# EAGLE schematic power_board2_v1.0 (EAGLE 9.5.1)
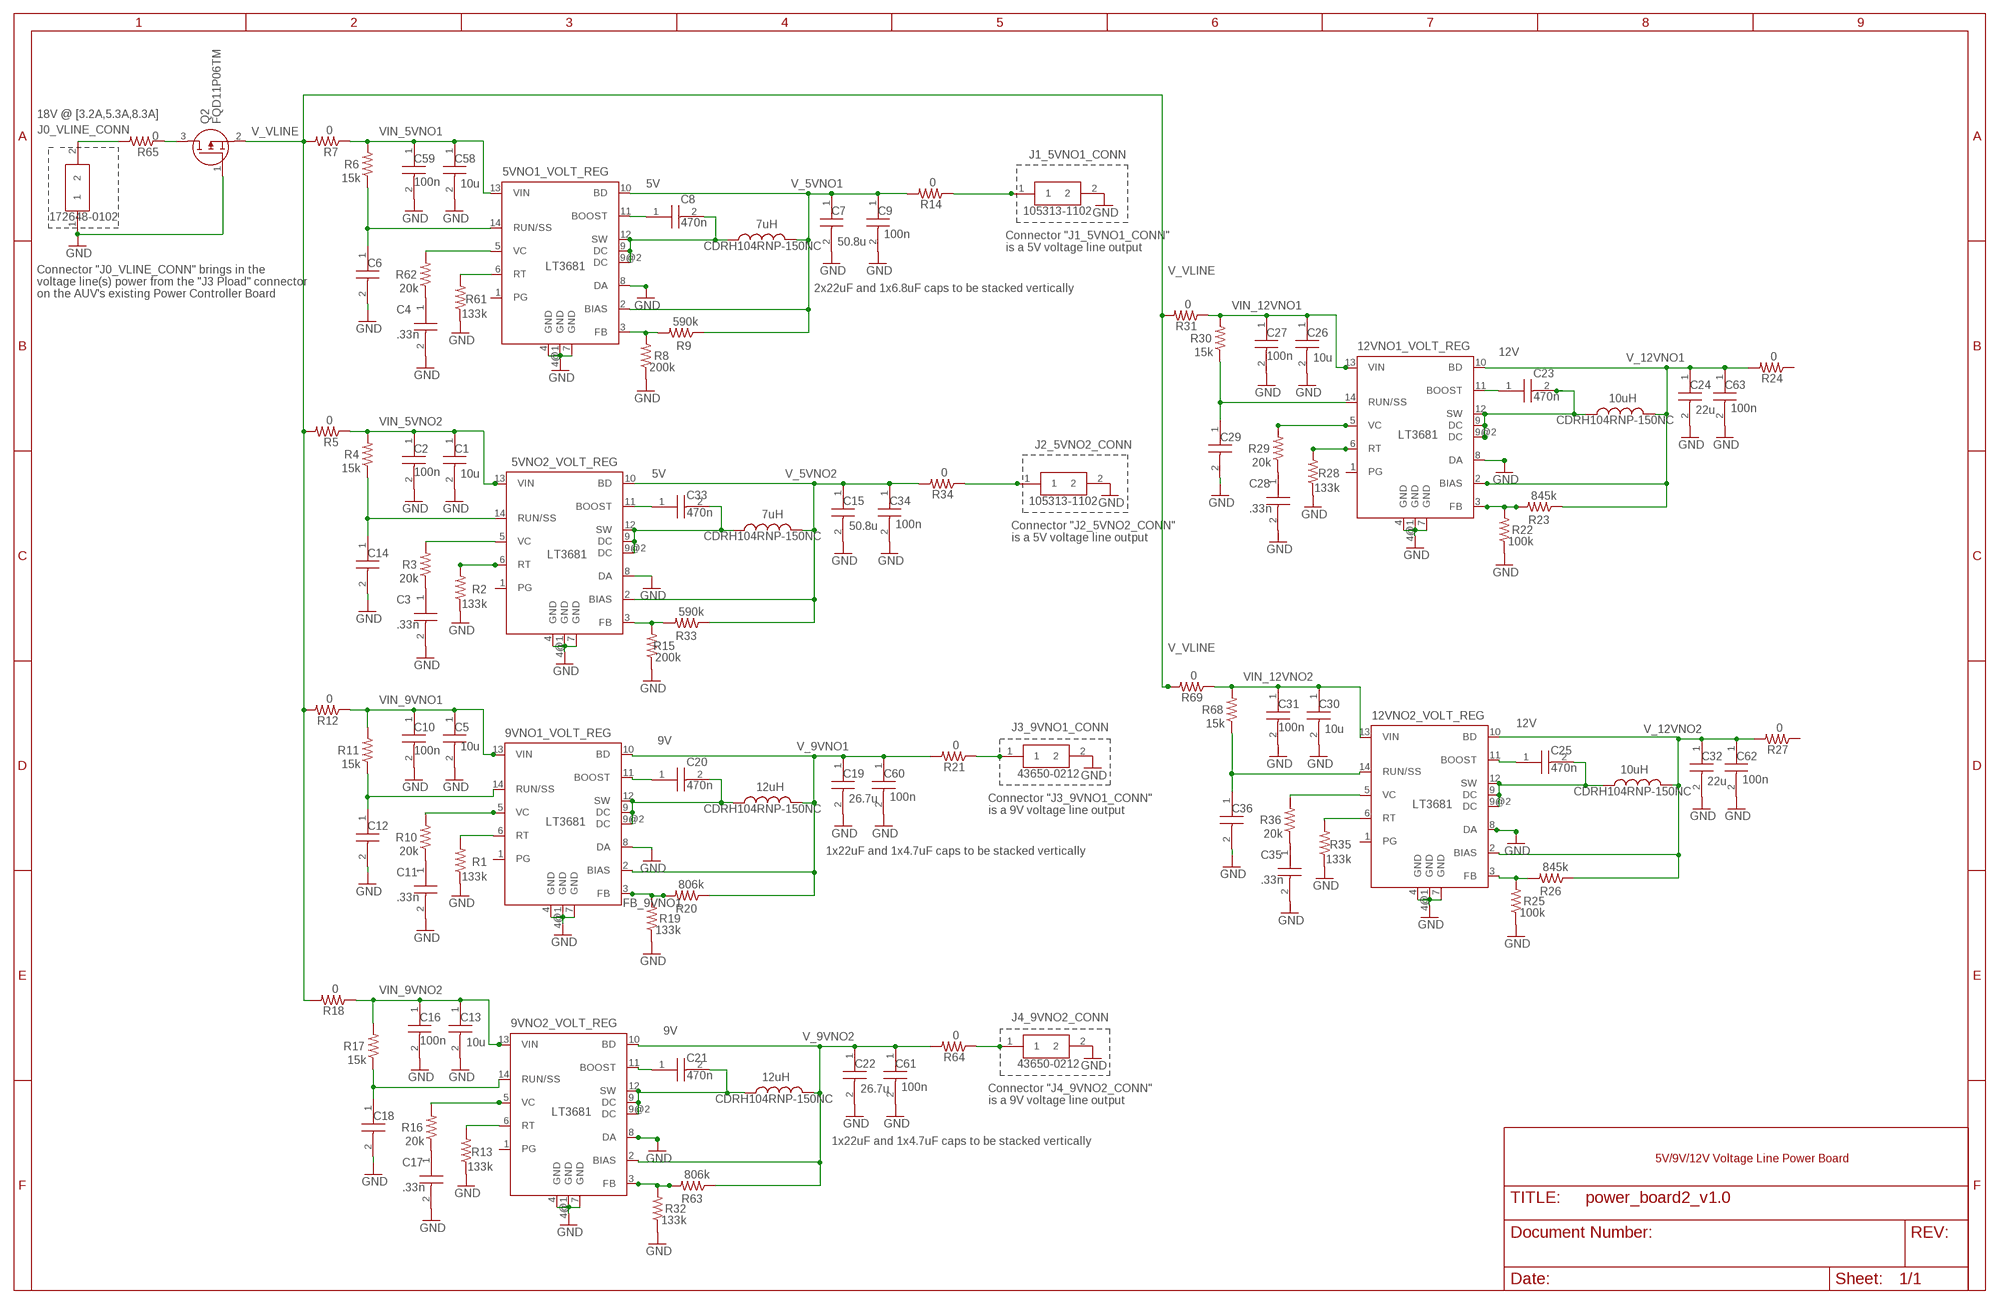
[diagram p0: schematic, sheet 1]

## Parts
5VNO1_VOLT_REG  LT3681  [DFN14-4X3DE]
5VNO2_VOLT_REG  LT3681  [DFN14-4X3DE]
9VNO1_VOLT_REG  LT3681  [DFN14-4X3DE]
9VNO2_VOLT_REG  LT3681  [DFN14-4X3DE]
12VNO1_VOLT_REG  LT3681  [DFN14-4X3DE]
12VNO2_VOLT_REG  LT3681  [DFN14-4X3DE]
C1  10u  22201C106KAT2A  [CAPC5750X279N]
C2  100n  06031C104KAT2A  [CAPC1608X90N]
C3  .33n  08053C334KAT2A  [CAPC2012X140N]
C4  .33n  08053C334KAT2A  [CAPC2012X140N]
C5  10u  22201C106KAT2A  [CAPC5750X279N]
C6  220n  08051C224KAT2A  [CAPC2012X140N]
C7  50.8u  12103C226KAT2A  [CAPC3225X279N]
C8  470n  06033C474JAT2A  [CAPC1608X90N]
C9  100n  06033C104KAT4A  [CAPC1608X90N]
C10  100n  06031C104KAT2A  [CAPC1608X90N]
C11  .33n  08053C334KAT2A  [CAPC2012X140N]
C12  220n  08051C224KAT2A  [CAPC2012X140N]
C13  10u  22201C106KAT2A  [CAPC5750X279N]
C14  220n  08051C224KAT2A  [CAPC2012X140N]
C15  50.8u  12103C226KAT2A  [CAPC3225X279N]
C16  100n  06031C104KAT2A  [CAPC1608X90N]
C17  .33n  08053C334KAT2A  [CAPC2012X140N]
C18  220n  08051C224KAT2A  [CAPC2012X140N]
C19  26.7u  12103C226KAT2A  [CAPC3225X279N]
C20  470n  06033C474JAT2A  [CAPC1608X90N]
C21  470n  06033C474JAT2A  [CAPC1608X90N]
C22  26.7u  12103C226KAT2A  [CAPC3225X279N]
C23  470n  06033C474JAT2A  [CAPC1608X90N]
C24  50.8u  12103C226KAT2A  [CAPC3225X279N]
C25  470n  06033C474JAT2A  [CAPC1608X90N]
C26  10u  22201C106KAT2A  [CAPC5750X279N]
C27  100n  06031C104KAT2A  [CAPC1608X90N]
C28  .33n  08053C334KAT2A  [CAPC2012X140N]
C29  220n  08051C224KAT2A  [CAPC2012X140N]
C30  10u  22201C106KAT2A  [CAPC5750X279N]
C31  100n  06031C104KAT2A  [CAPC1608X90N]
C32  50.8u  12103C226KAT2A  [CAPC3225X279N]
C33  470n  06033C474JAT2A  [CAPC1608X90N]
C34  100n  06033C104KAT4A  [CAPC1608X90N]
C35  .33n  08053C334KAT2A  [CAPC2012X140N]
C36  220n  08051C224KAT2A  [CAPC2012X140N]
C58  10u  22201C106KAT2A  [CAPC5750X279N]
C59  100n  06031C104KAT2A  [CAPC1608X90N]
C60  100n  06033C104KAT4A  [CAPC1608X90N]
C61  100n  06033C104KAT4A  [CAPC1608X90N]
C62  100n  06033C104KAT4A  [CAPC1608X90N]
C63  100n  06033C104KAT4A  [CAPC1608X90N]
INDUCTOR_2  CDRH104RNP-150NC  [INDPM102100X400N]
INDUCTOR_4  CDRH104RNP-150NC  [INDPM102100X400N]
INDUCTOR_5  CDRH104RNP-150NC  [INDPM102100X400N]
INDUCTOR_6  CDRH104RNP-150NC  [INDPM102100X400N]
INDUCTOR_7  CDRH104RNP-150NC  [INDPM102100X400N]
INDUCTOR_8  CDRH104RNP-150NC  [INDPM102100X400N]
J0_VLINE_CONN  172648-0102  [1726480102]
J1_B3_CONN1  105313-1102  [1053131102]
J1_B3_CONN2  105313-1102  [1053131102]
J3_9VNO1_CONN  43650-0212  [43650-0214]
J4_9VNO2_CONN  43650-0212  [43650-0214]
Q2  FQD11P06TM  [DPAK3-CASE-369AS]
R1  133k  R-US_R0603  [R0603]
R2  133k  R-US_R0603  [R0603]
R3  20k  R-US_R0603  [R0603]
R4  15k  R-US_R0603  [R0603]
R5  0  R-US_0207/2V  [0207/2V]
R6  15k  R-US_R0603  [R0603]
R7  0  R-US_0207/2V  [0207/2V]
R8  200k  R-US_R0603  [R0603]
R9  590k  R-US_R0603  [R0603]
R10  20k  R-US_R0603  [R0603]
R11  15k  R-US_R0603  [R0603]
R12  0  R-US_0207/2V  [0207/2V]
R13  133k  R-US_R0603  [R0603]
R14  0  R-US_0207/2V  [0207/2V]
R15  200k  R-US_R0603  [R0603]
R16  20k  R-US_R0603  [R0603]
R17  15k  R-US_R0603  [R0603]
R18  0  R-US_0207/2V  [0207/2V]
R19  133k  R-US_R0603  [R0603]
R20  806k  R-US_R0603  [R0603]
R21  0  R-US_0207/2V  [0207/2V]
R22  100k  R-US_R0603  [R0603]
R23  845k  R-US_R0603  [R0603]
R24  0  R-US_0207/2V  [0207/2V]
R25  100k  R-US_R0603  [R0603]
R26  845k  R-US_R0603  [R0603]
R27  0  R-US_0207/2V  [0207/2V]
R28  133k  R-US_R0603  [R0603]
R29  20k  R-US_R0603  [R0603]
R30  15k  R-US_R0603  [R0603]
R31  0  R-US_0207/2V  [0207/2V]
R32  133k  R-US_R0603  [R0603]
R33  590k  R-US_R0603  [R0603]
R34  0  R-US_0207/2V  [0207/2V]
R35  133k  R-US_R0603  [R0603]
R36  20k  R-US_R0603  [R0603]
R61  133k  R-US_R0603  [R0603]
R62  20k  R-US_R0603  [R0603]
R63  806k  R-US_R0603  [R0603]
R64  0  R-US_0207/2V  [0207/2V]
R65  0  R-US_0207/2V  [0207/2V]
R68  15k  R-US_R0603  [R0603]
R69  0  R-US_0207/2V  [0207/2V]

## Nets
FB_5VNO1: 5VNO1_VOLT_REG.3(FB) R8.2 R9.2
FB_5VNO2: 5VNO2_VOLT_REG.3(FB) R15.2 R33.2
FB_9VNO1: 9VNO1_VOLT_REG.3(FB) R19.2 R20.2
FB_9VNO2: 9VNO2_VOLT_REG.3(FB) R32.2 R63.2
FB_12VNO1: 12VNO1_VOLT_REG.3(FB) R22.2 R23.2
FB_12VNO2: 12VNO2_VOLT_REG.3(FB) R25.2 R26.2
GND: 5VNO1_VOLT_REG.4(GND) 5VNO1_VOLT_REG.4@1(GND) 5VNO1_VOLT_REG.7(GND) 5VNO1_VOLT_REG.8(DA) 5VNO2_VOLT_REG.4(GND) 5VNO2_VOLT_REG.4@1(GND) 5VNO2_VOLT_REG.7(GND) 5VNO2_VOLT_REG.8(DA) 9VNO1_VOLT_REG.4(GND) 9VNO1_VOLT_REG.4@1(GND) 9VNO1_VOLT_REG.7(GND) 9VNO1_VOLT_REG.8(DA) 9VNO2_VOLT_REG.4(GND) 9VNO2_VOLT_REG.4@1(GND) 9VNO2_VOLT_REG.7(GND) 9VNO2_VOLT_REG.8(DA) 12VNO1_VOLT_REG.4(GND) 12VNO1_VOLT_REG.4@1(GND) 12VNO1_VOLT_REG.7(GND) 12VNO1_VOLT_REG.8(DA) 12VNO2_VOLT_REG.4(GND) 12VNO2_VOLT_REG.4@1(GND) 12VNO2_VOLT_REG.7(GND) C1.2 C2.2 C3.2 C4.2 C5.2 C6.2 C7.2 C9.2 C10.2 C11.2 C12.2 C13.2 C14.2 C15.2 C16.2 C17.2 C18.2 C19.2 C22.2 C24.2 C26.2 C27.2 C28.2 C29.2 C30.2 C31.2 C32.2 C34.2 C35.2 C36.2 C58.2 C59.2 C60.2 C61.2 C62.2 C63.2 J0_VLINE_CONN.1 J1_B3_CONN1.2 J1_B3_CONN2.2 J3_9VNO1_CONN.2 J4_9VNO2_CONN.2 Q2.1(G) R1.1 R2.1 R8.1 R13.1 R15.1 R19.1 R22.1 R25.1 R28.1 R32.1 R35.1 R61.1
N$1: C4.1 R62.1
N$2: 12VNO2_VOLT_REG.11(BOOST) C25.1
N$3: 12VNO1_VOLT_REG.11(BOOST) C23.1
N$4: C3.1 R3.1
N$5: C11.1 R10.1
N$6: C17.1 R16.1
N$7: 5VNO2_VOLT_REG.11(BOOST) C33.1
N$8: J4_9VNO2_CONN.1 R64.1
N$9: 9VNO2_VOLT_REG.11(BOOST) C21.1
N$10: 5VNO1_VOLT_REG.11(BOOST) C8.1
N$11: 9VNO1_VOLT_REG.11(BOOST) C20.1
N$12: J3_9VNO1_CONN.1 R21.1
N$17: C28.1 R29.1
N$18: C35.1 R36.1
RT_5VNO1: 5VNO1_VOLT_REG.6(RT) R61.2
RT_5VNO2: 5VNO2_VOLT_REG.6(RT) R2.2
RT_9VNO1: 9VNO1_VOLT_REG.6(RT) R1.2
RT_9VNO2: 9VNO2_VOLT_REG.6(RT) R13.2
RT_12VNO1: 12VNO1_VOLT_REG.6(RT) R28.2
RT_12VNO2: 12VNO2_VOLT_REG.6(RT) R35.2
RUN/SS_5VNO1: 5VNO1_VOLT_REG.14(RUN/SS) C6.1 R6.1
RUN/SS_5VNO2: 5VNO2_VOLT_REG.14(RUN/SS) C14.1 R4.1
RUN/SS_9VNO1: 9VNO1_VOLT_REG.14(RUN/SS) C12.1 R11.1
RUN/SS_9VNO2: 9VNO2_VOLT_REG.14(RUN/SS) C18.1 R17.1
RUN/SS_12VNO1: 12VNO1_VOLT_REG.14(RUN/SS) C29.1 R30.1
RUN/SS_12VNO2: 12VNO2_VOLT_REG.14(RUN/SS) C36.1 R68.1
SW_5VNO1: 5VNO1_VOLT_REG.9(DC) 5VNO1_VOLT_REG.9@2(DC) 5VNO1_VOLT_REG.12(SW) C8.2 INDUCTOR_2.1
SW_5VNO2: 5VNO2_VOLT_REG.9(DC) 5VNO2_VOLT_REG.9@2(DC) 5VNO2_VOLT_REG.12(SW) C33.2 INDUCTOR_4.1
SW_9VNO1: 9VNO1_VOLT_REG.9(DC) 9VNO1_VOLT_REG.9@2(DC) 9VNO1_VOLT_REG.12(SW) C20.2 INDUCTOR_5.1
SW_9VNO2: 9VNO2_VOLT_REG.9(DC) 9VNO2_VOLT_REG.9@2(DC) 9VNO2_VOLT_REG.12(SW) C21.2 INDUCTOR_6.1
SW_12VNO1: 12VNO1_VOLT_REG.9(DC) 12VNO1_VOLT_REG.9@2(DC) 12VNO1_VOLT_REG.12(SW) C23.2 INDUCTOR_7.1
SW_12VNO2: 12VNO2_VOLT_REG.9(DC) 12VNO2_VOLT_REG.9@2(DC) 12VNO2_VOLT_REG.12(SW) C25.2 INDUCTOR_8.1
V_5VNO1: 5VNO1_VOLT_REG.2(BIAS) 5VNO1_VOLT_REG.10(BD) C7.1 C9.1 INDUCTOR_2.2 R9.1 R14.2
V_5VNO1_0: J1_B3_CONN1.1 R14.1
V_5VNO2: 5VNO2_VOLT_REG.2(BIAS) 5VNO2_VOLT_REG.10(BD) C15.1 C34.1 INDUCTOR_4.2 R33.1 R34.2
V_5VNO2_0: J1_B3_CONN2.1 R34.1
V_9VNO1: 9VNO1_VOLT_REG.2(BIAS) 9VNO1_VOLT_REG.10(BD) C19.1 C60.1 INDUCTOR_5.2 R20.1 R21.2
V_9VNO2: 9VNO2_VOLT_REG.2(BIAS) 9VNO2_VOLT_REG.10(BD) C22.1 C61.1 INDUCTOR_6.2 R63.1 R64.2
V_12VNO1: 12VNO1_VOLT_REG.2(BIAS) 12VNO1_VOLT_REG.10(BD) C24.1 C63.1 INDUCTOR_7.2 R23.1 R24.2
V_12VNO2: 12VNO2_VOLT_REG.2(BIAS) 12VNO2_VOLT_REG.10(BD) C32.1 C62.1 INDUCTOR_8.2 R26.1 R27.2
V_VLINE: Q2.2(S) R5.2 R7.2 R12.2 R18.2 R31.2 R69.2
V_VLINE00: J0_VLINE_CONN.2 R65.2
V_VLINE0: Q2.3(D) R65.1
VC_5VNO1: 5VNO1_VOLT_REG.5(VC) R62.2
VC_5VNO2: 5VNO2_VOLT_REG.5(VC) R3.2
VC_9VNO1: 9VNO1_VOLT_REG.5(VC) R10.2
VC_9VNO2: 9VNO2_VOLT_REG.5(VC) R16.2
VC_12VNO1: 12VNO1_VOLT_REG.5(VC) R29.2
VC_12VNO2: 12VNO2_VOLT_REG.5(VC) R36.2
VIN_5VNO1: 5VNO1_VOLT_REG.13(VIN) C58.1 C59.1 R6.2 R7.1
VIN_5VNO2: 5VNO2_VOLT_REG.13(VIN) C1.1 C2.1 R4.2 R5.1
VIN_9VNO1: 9VNO1_VOLT_REG.13(VIN) C5.1 C10.1 R11.2 R12.1
VIN_9VNO2: 9VNO2_VOLT_REG.13(VIN) C13.1 C16.1 R17.2 R18.1
VIN_12VNO1: 12VNO1_VOLT_REG.13(VIN) C26.1 C27.1 R30.2 R31.1
VIN_12VNO2: 12VNO2_VOLT_REG.13(VIN) C30.1 C31.1 R68.2 R69.1
Unconnected: 5VNO1_VOLT_REG.1(PG) 5VNO2_VOLT_REG.1(PG) 9VNO1_VOLT_REG.1(PG) 9VNO2_VOLT_REG.1(PG) 12VNO1_VOLT_REG.1(PG) 12VNO2_VOLT_REG.1(PG) 12VNO2_VOLT_REG.8(DA) R24.1 R27.1

## Notes on the sheet
- 18V @ [3.2A,5.3A,8.3A]
- J1_5VNO1_CONN
- 10u | 5V
- 7uH
- 50.8u
- Connector "J1_5VNO1_CONN"
  is a 5V voltage line output
- 2x22uF and 1x6.8uF caps to be stacked vertically
- Connector "J0_VLINE_CONN" brings in the
  voltage line(s) power from the "J3 Pload" connector
  on the AUV's existing Power Controller Board
- .33n
- 12V
- 10u
- 10uH
- 22u
- J2_5VNO2_CONN
- 10u | 5V
- .33n
- 7uH
- 50.8u
- Connector "J2_5VNO2_CONN"
  is a 5V voltage line output
- .33n
- 12V
- 10u
- 9V
- 10u
- 10uH
- 22u
- 12uH
- 26.7u
- Connector "J3_9VNO1_CONN" 
  is a 9V voltage line output
- 1x22uF and 1x4.7uF caps to be stacked vertically
- .33n
- .33n
- 9V
- 10u
- 12uH
- 26.7u
- Connector "J4_9VNO2_CONN"
  is a 9V voltage line output
- 1x22uF and 1x4.7uF caps to be stacked vertically
- 5V/9V/12V Voltage Line Power Board
- .33n

## Library data of the parts
5VNO1_VOLT_REG 5VNO2_VOLT_REG 9VNO1_VOLT_REG 9VNO2_VOLT_REG 12VNO1_VOLT_REG 12VNO2_VOLT_REG = linear-technology:LT3681: 36V, 2A, 2.8MHz Step-Down Switching Regulator with Integrated Power Schottky Diode Source: http://www.linear.com/pc/downloadDocument.do?navId=H0,C1,C1003,C1042,C1032,C1064,P38040,D25144; MPN: LT3681EDE#PBF; OC_FARNELL: 1627603; OC_NEWARK: 57M8550
C1 C5 C13 C26 C30 C58 = 22201C106KAT2A:22201C106KAT2A: Cap Ceramic 10uF 100V X7R 10% Pad SMD 2220 125C T/R Source: Datasheet <https://www.mouser.com/datasheet/2/40/X7RDielectric-777024.pdf>; DESCRIPTION: Cap Ceramic 10uF 100V X7R 10% Pad SMD 2220 125C T/R; HEIGHT: 2.79mm; MANUFACTURER_NAME: AVX; MANUFACTURER_PART_NUMBER: 22201C106KAT2A; MOUSER_PART_NUMBER: 581-22201C106KAT2A; MOUSER_PRICE-STOCK: https://www.mouser.com/Search/Refine.aspx?Keyword=581-22201C106KAT2A
C2 C10 C16 C27 C31 C59 = 06031C104KAT2A:06031C104KAT2A: AVX - 06031C104KAT2A - CAP, MLCC, X7R, 0.1UF, 100V, 0603 Source: Datasheet <https://componentsearchengine.com/Datasheets/1/06031A100FAT2A.pdf>; DESCRIPTION: AVX - 06031C104KAT2A - CAP, MLCC, X7R, 0.1UF, 100V, 0603; HEIGHT: 0.9mm; MANUFACTURER_NAME: AVX; MANUFACTURER_PART_NUMBER: 06031C104KAT2A; MOUSER_PART_NUMBER: 581-06031C104KAT2A; MOUSER_PRICE-STOCK: https://www.mouser.com/Search/Refine.aspx?Keyword=581-06031C104KAT2A
C3 C4 C11 C17 C28 C35 = 08053C334KAT2A:08053C334KAT2A: AVX 0805 Standard 0.33uF Ceramic Multilayer Capacitor, 25 V dc, +125 Source: Datasheet <http://datasheets.avx.com/X7RDielectric.pdf>; DESCRIPTION: AVX 0805 Standard 0.33uF Ceramic Multilayer Capacitor, 25 V dc, +125; HEIGHT: 1.4mm; MANUFACTURER_NAME: AVX; MANUFACTURER_PART_NUMBER: 08053C334KAT2A; MOUSER_PART_NUMBER: 581-08053C334KAT2A; MOUSER_PRICE-STOCK: https://www.mouser.com/Search/Refine.aspx?Keyword=581-08053C334KAT2A; RS_PART_NUMBER: 1747387; RS_PRICE-STOCK: http://uk.rs-online.com/web/p/products/1747387
C6 C12 C14 C18 C29 C36 = 08051C224KAT2A:08051C224KAT2A: Cap Ceramic 0.22uF 100V X7R 10% Pad SMD 0805 125C T/R Source: Datasheet <https://www.mouser.com/datasheet/2/40/X7RDielectric-777024.pdf>; DESCRIPTION: Cap Ceramic 0.22uF 100V X7R 10% Pad SMD 0805 125C T/R; HEIGHT: 1.4mm; MANUFACTURER_NAME: AVX; MANUFACTURER_PART_NUMBER: 08051C224KAT2A; MOUSER_PART_NUMBER: 581-08051C224KAT2A; MOUSER_PRICE-STOCK: https://www.mouser.com/Search/Refine.aspx?Keyword=581-08051C224KAT2A
C7 C15 C19 C22 C24 C32 = 12103C226KAT2A:12103C226KAT2A: Multilayer Ceramic Capacitors MLCC - SMD/SMT 25V 22uF X7R 1210 0.1 Source: Datasheet <https://componentsearchengine.com/Datasheets/1/12103C226KAT2A.pdf>; DESCRIPTION: Multilayer Ceramic Capacitors MLCC - SMD/SMT 25V 22uF X7R 1210 0.1; HEIGHT: 2.79mm; MANUFACTURER_NAME: AVX; MANUFACTURER_PART_NUMBER: 12103C226KAT2A; MOUSER_PART_NUMBER: 581-12103C226KAT2A; MOUSER_PRICE-STOCK: https://www.mouser.com/Search/Refine.aspx?Keyword=581-12103C226KAT2A
C8 C20 C21 C23 C25 C33 = 06033C474JAT2A:06033C474JAT2A: Multilayer Ceramic Capacitors MLCC - SMD/SMT 25V 470nF X7R 0603 +5% Source: Datasheet <https://componentsearchengine.com/Datasheets/1/06031A100FAT2A.pdf>; DESCRIPTION: Multilayer Ceramic Capacitors MLCC - SMD/SMT 25V 470nF X7R 0603 +5%; HEIGHT: 0.9mm; MANUFACTURER_NAME: AVX; MANUFACTURER_PART_NUMBER: 06033C474JAT2A; MOUSER_PART_NUMBER: 581-06033C474JAT2A; MOUSER_PRICE-STOCK: https://www.mouser.com/Search/Refine.aspx?Keyword=581-06033C474JAT2A
C9 C34 C60-C63 = 06033C104KAT4A:06033C104KAT4A: Multilayer Ceramic Capacitors MLCC - SMD/SMT 25volts 0.1uF 10% X7R Source: Datasheet <http://www.mouser.com/catalog/supplier/library/pdf/AVXSurfaceMountCeramic.pdf>; DESCRIPTION: Multilayer Ceramic Capacitors MLCC - SMD/SMT 25volts 0.1uF 10% X7R; HEIGHT: 0.9mm; MANUFACTURER_NAME: AVX; MANUFACTURER_PART_NUMBER: 06033C104KAT4A; MOUSER_PART_NUMBER: 581-06033C104KAT4A; MOUSER_PRICE-STOCK: https://www.mouser.com/Search/Refine.aspx?Keyword=581-06033C104KAT4A
INDUCTOR_2 INDUCTOR_4-INDUCTOR_8 = CDRH104RNP-150NC:CDRH104RNP-150NC: Fixed Inductors 15uH 3.1A Source: Datasheet <http://products.sumida.com/products/pdf/CDRH104R.pdf>; DESCRIPTION: Fixed Inductors 15uH 3.1A; HEIGHT: 4mm; MANUFACTURER_NAME: Sumida; MANUFACTURER_PART_NUMBER: CDRH104RNP-150NC; MOUSER_PART_NUMBER: 851-CDRH104RNP-150NC; MOUSER_PRICE-STOCK: https://www.mouser.com/Search/Refine.aspx?Keyword=851-CDRH104RNP-150NC
J0_VLINE_CONN = 172648-0102:172648-0102: Board to Board & Mezzanine Connectors Source: Datasheet <https://www.molex.com/pdm_docs/sd/1726480102_sd.pdf>; DESCRIPTION: Board to Board & Mezzanine Connectors; HEIGHT: 5.4mm; MANUFACTURER_NAME: Molex; MANUFACTURER_PART_NUMBER: 172648-0102; MOUSER_PART_NUMBER: 538-172648-0102; MOUSER_PRICE-STOCK: https://www.mouser.com/Search/Refine.aspx?Keyword=538-172648-0102
J1_B3_CONN1 J1_B3_CONN2 = 105313-1102:105313-1102: Molex Nano-Fit 105313, 2.5mm Pitch, 2 Way, 1 Row, Right Angle PCB Header, Through Hole Source: Datasheet <https://www.molex.com/molex/products/datasheet.jsp?part=active/1053131102_PCB_HEADERS.xml&channel=Products&Lang=en-US>; DESCRIPTION: Molex Nano-Fit 105313, 2.5mm Pitch, 2 Way, 1 Row, Right Angle PCB Header, Through Hole; HEIGHT: 6.84mm; MANUFACTURER_NAME: Molex; MANUFACTURER_PART_NUMBER: 105313-1102; MOUSER_PART_NUMBER: 538-105313-1102; MOUSER_PRICE-STOCK: https://www.mouser.com/Search/Refine.aspx?Keyword=538-105313-1102; RS_PART_NUMBER: 1623686; RS_PRICE-STOCK: http://uk.rs-online.com/web/p/products/1623686
J3_9VNO1_CONN J4_9VNO2_CONN = 43650-0212:43650-0212: Molex MICRO-FIT 3.0 Series, Series Number 43650, 3mm Pitch 2 Way 1 Row Shrouded Right Angle PCB Header, Surface Mount Source: Datasheet <https://componentsearchengine.com/Datasheets/2/43650-0212.pdf>; ALLIED_NUMBER: 70266892; ALLIED_PRICE-STOCK: https://www.alliedelec.com/molex-incorporated-43650-0212/70266892/; DESCRIPTION: Molex MICRO-FIT 3.0 Series, Series Number 43650, 3mm Pitch 2 Way 1 Row Shrouded Right Angle PCB Header, Surface Mount; HEIGHT: mm; MANUFACTURER_NAME: Molex; MANUFACTURER_PART_NUMBER: 43650-0212; MOUSER_PART_NUMBER: 538-43650-0212; MOUSER_PRICE-STOCK: https://www.mouser.com/Search/Refine.aspx?Keyword=538-43650-0212; RS_PART_NUMBER: 4476811P; RS_PRICE-STOCK: http://uk.rs-online.com/web/p/products/4476811P
Q2 = FQD11P06TM:FQD11P06TM: FQD11P06TM P-Channel MOSFET, 9.4 A, 60 V, 3-Pin DPAK ON Semiconductor Source: Datasheet <https://www.onsemi.com/pub/Collateral/FQU11P06-D.pdf>; DESCRIPTION: FQD11P06TM P-Channel MOSFET, 9.4 A, 60 V, 3-Pin DPAK ON Semiconductor; HEIGHT: mm; MANUFACTURER_NAME: ON Semiconductor; MANUFACTURER_PART_NUMBER: FQD11P06TM; MOUSER_PART_NUMBER: 512-FQD11P06TM; MOUSER_PRICE-STOCK: https://www.mouser.com/Search/Refine.aspx?Keyword=512-FQD11P06TM; RS_PART_NUMBER: 6710949P; RS_PRICE-STOCK: http://uk.rs-online.com/web/p/products/6710949P
R1-R4 R6 R8-R11 R13 R15-R17 R19 R20 R22 R23 R25 R26 R28-R30 R32 R33 R35 R36 R61-R63 R68 = rcl:R-US_: RESISTOR, American symbol; SPICEPREFIX: R
R5 R7 R12 R14 R18 R21 R24 R27 R31 R34 R64 R65 R69 = rcl:R-US_: RESISTOR, American symbol; DESC: RES SMD 10K OHM 1% 1/8W 0805; MFR: Yageo; MPN: RC0805FR-0710KL; SPICEPREFIX: R